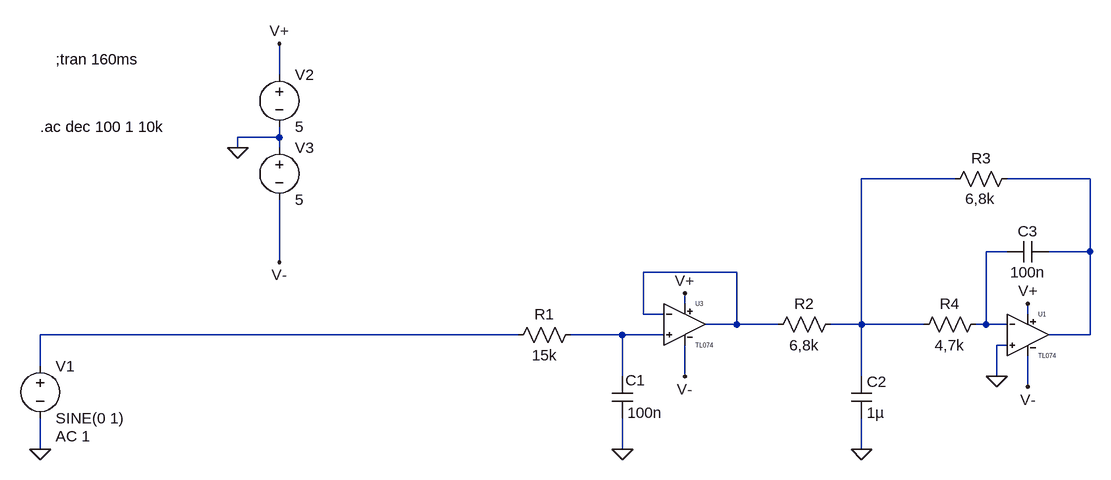
[diagram p0: schematic AlterFilter.asc]
AlterFilter.asc, the LTspice schematic file:
Version 4
SHEET 1 1352 680
WIRE -304 -336 -304 -384
WIRE -304 -240 -304 -256
WIRE -304 -240 -368 -240
WIRE -368 -224 -368 -240
WIRE -304 -224 -304 -240
WIRE 736 -176 592 -176
WIRE 944 -176 816 -176
WIRE 816 -64 784 -64
WIRE 944 -64 944 -176
WIRE 944 -64 880 -64
WIRE -304 -48 -304 -144
WIRE 400 -32 256 -32
WIRE 320 16 320 0
WIRE 256 32 256 -32
WIRE 288 32 256 32
WIRE 848 32 848 16
WIRE 400 48 400 -32
WIRE 400 48 352 48
WIRE 464 48 400 48
WIRE 592 48 592 -176
WIRE 592 48 544 48
WIRE 688 48 592 48
WIRE 784 48 784 -64
WIRE 784 48 768 48
WIRE 816 48 784 48
WIRE 64 64 -672 64
WIRE 224 64 144 64
WIRE 288 64 224 64
WIRE 944 64 944 -64
WIRE 944 64 880 64
WIRE 816 80 800 80
WIRE -672 112 -672 64
WIRE 224 128 224 64
WIRE 320 128 320 80
WIRE 592 128 592 48
WIRE 800 128 800 80
WIRE 848 144 848 96
WIRE -672 240 -672 192
WIRE 224 240 224 192
WIRE 592 240 592 192
FLAG 224 240 0
FLAG 592 240 0
FLAG 800 128 0
FLAG -672 240 0
FLAG -304 -384 V+
FLAG 320 0 V+
FLAG 848 16 V+
FLAG 848 144 V-
FLAG 320 128 V-
FLAG -304 -48 V-
FLAG -368 -224 0
SYMBOL cap 208 128 R0
WINDOW 0 21 6 Left 2
SYMATTR InstName C1
SYMATTR Value 100n
SYMBOL cap 576 128 R0
SYMATTR InstName C2
SYMATTR Value 1µ
SYMBOL cap 880 -80 R90
WINDOW 0 0 32 VBottom 2
WINDOW 3 32 32 VTop 2
SYMATTR InstName C3
SYMATTR Value 100n
SYMBOL res 160 48 R90
WINDOW 0 0 56 VBottom 2
WINDOW 3 32 56 VTop 2
SYMATTR InstName R1
SYMATTR Value 15k
SYMBOL res 560 32 R90
WINDOW 0 0 56 VBottom 2
WINDOW 3 32 56 VTop 2
SYMATTR InstName R2
SYMATTR Value 6,8k
SYMBOL res 832 -192 R90
WINDOW 0 0 56 VBottom 2
WINDOW 3 31 57 VTop 2
SYMATTR InstName R3
SYMATTR Value 6,8k
SYMBOL res 784 32 R90
WINDOW 0 0 56 VBottom 2
WINDOW 3 32 56 VTop 2
SYMATTR InstName R4
SYMATTR Value 4,7k
SYMBOL voltage -672 96 R0
WINDOW 123 24 124 Left 2
WINDOW 39 0 0 Left 2
SYMATTR Value2 AC 1
SYMATTR InstName V1
SYMATTR Value SINE(0 1)
SYMBOL voltage -304 -352 R0
WINDOW 123 0 0 Left 2
WINDOW 39 0 0 Left 2
SYMATTR InstName V2
SYMATTR Value 5
SYMBOL voltage -304 -240 R0
WINDOW 123 0 0 Left 2
WINDOW 39 0 0 Left 2
SYMATTR InstName V3
SYMATTR Value 5
SYMBOL Opamps\\TL074 320 -16 R0
SYMATTR InstName U3
SYMBOL Opamps\\TL074 848 0 R0
SYMATTR InstName U1
TEXT -648 -360 Left 2 !;tran 160ms
TEXT -672 -256 Left 2 !.ac dec 100 1 10k

The netlist it stands for:
* AlterFilter.asc
C1 N006 0 100n
C2 N001 0 1µ
C3 N002 N003 100n
R1 N006 N005 15k
R2 N001 N004 6,8k
R3 N002 N001 6,8k
R4 N003 N001 4,7k
V1 N005 0 SINE(0 1) AC 1
V2 V+ 0 5
V3 0 V- 5
XU3 N006 N004 V+ V- N004 TL074  ; pins In+ In- V+ V- OUT
XU1 0 N003 V+ V- N002 TL074  ; pins In+ In- V+ V- OUT
;tran 160ms
.ac dec 100 1 10k
.lib OWN.lib
.backanno
.end